# Altium schematic sheet MODULE.SchDoc
size A4
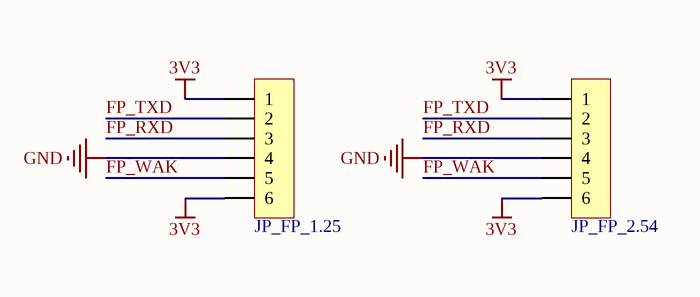
[diagram p0: MODULE.SchDoc]

## Parts
JP_FP_1.25  HDR-1X6  [MX 1.25-WS-6P]  (value not drawn)
JP_FP_2.54  HDR-1X6  [HDR2.54-LI-6P]  (value not drawn)

## Nets
3V3: JP_FP_1.25.1 JP_FP_1.25.6 JP_FP_2.54.1 JP_FP_2.54.6
GND: JP_FP_1.25.4 JP_FP_2.54.4
FP_RXD: JP_FP_1.25.3 JP_FP_2.54.3
FP_TXD: JP_FP_1.25.2 JP_FP_2.54.2
FP_WAK: JP_FP_1.25.5 JP_FP_2.54.5

## Library data of the parts
JP_FP_1.25 JP_FP_2.54 = Header 6: 6P接插件; 版权归属: 源创客; BOM名称: 6P接插件; 学习资源: www.ooocke.com